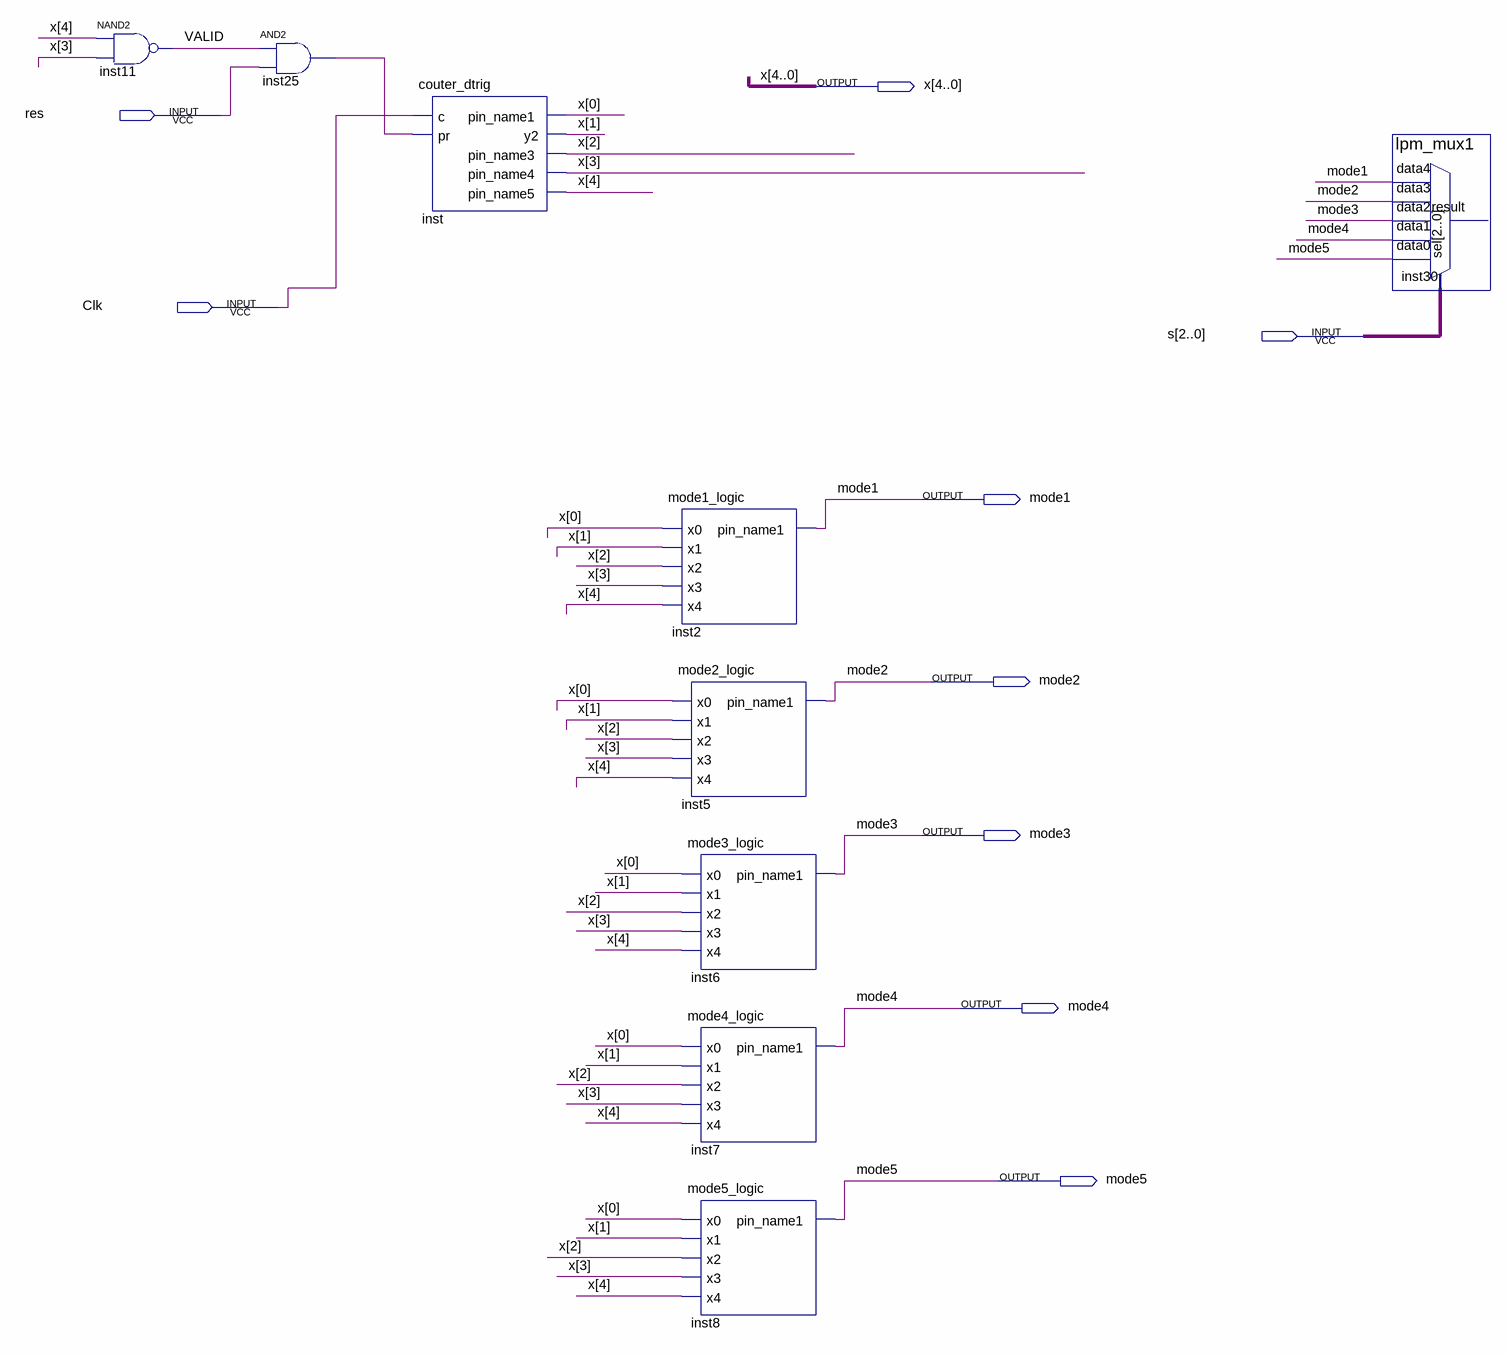
[diagram p0: schematic sheet]
// Quartus schematic cours.bdf as structural Verilog: 9 symbols, 9 pins
module cours (
  input  res,
  input  Clk,
  input  [2:0] s,
  output [4:0] x,
  output mode1,
  output mode2,
  output mode3,
  output mode4,
  output mode5
);

  wire inst25_out, VALID;

  nand inst11 (VALID, x[4], x[3]);
  and inst25 (inst25_out, VALID, res);
  couter_dtrig inst (
    .c(Clk), .pr(inst25_out), .pin_name1(x[0]), .y2(x[1]), .pin_name3(x[2]), .pin_name4(x[3]),
    .pin_name5(x[4]));
  mode1_logic inst2 (.x0(x[0]), .x1(x[1]), .x2(x[2]), .x3(x[3]), .x4(x[4]), .pin_name1(mode1));
  mode2_logic inst5 (.x0(x[0]), .x1(x[1]), .x2(x[2]), .x3(x[3]), .x4(x[4]), .pin_name1(mode2));
  mode3_logic inst6 (.x0(x[0]), .x1(x[1]), .x2(x[2]), .x3(x[3]), .x4(x[4]), .pin_name1(mode3));
  mode4_logic inst7 (.x0(x[0]), .x1(x[1]), .x2(x[2]), .x3(x[3]), .x4(x[4]), .pin_name1(mode4));
  mode5_logic inst8 (.x0(x[0]), .x1(x[1]), .x2(x[2]), .x3(x[3]), .x4(x[4]), .pin_name1(mode5));
  lpm_mux1 inst30 (.data4(mode1), .data3(mode2), .data2(mode3), .data1(mode4), .data0(mode5), .sel(s));  // open: result
endmodule
